# EAGLE design wrist - source (EAGLE 9.6.2)
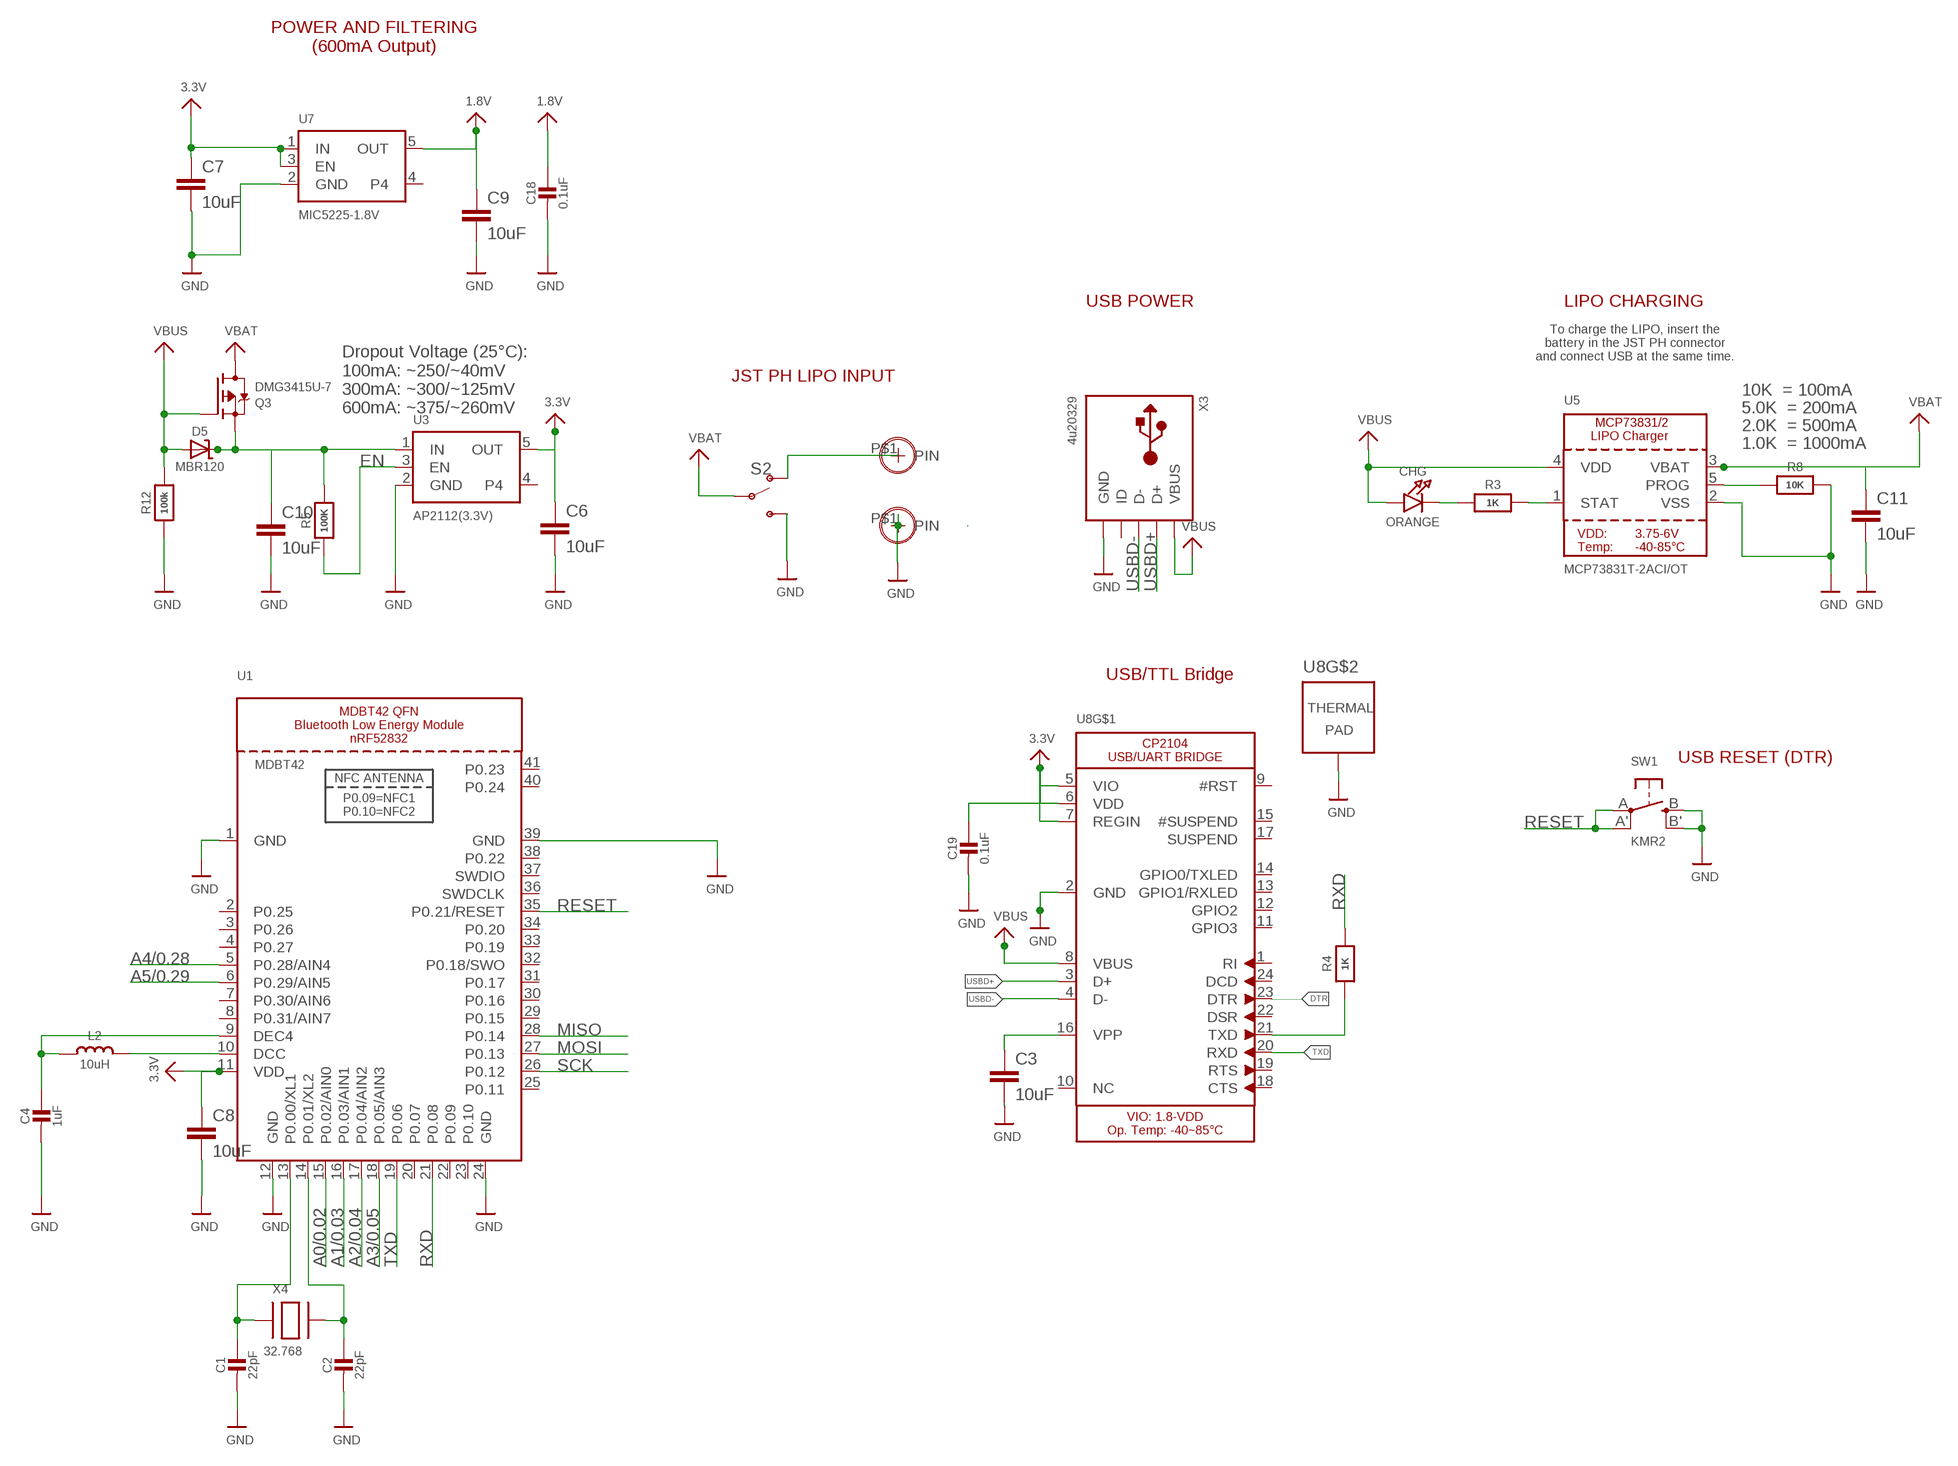
[diagram p0: schematic, sheet 1, part 1 of 2]
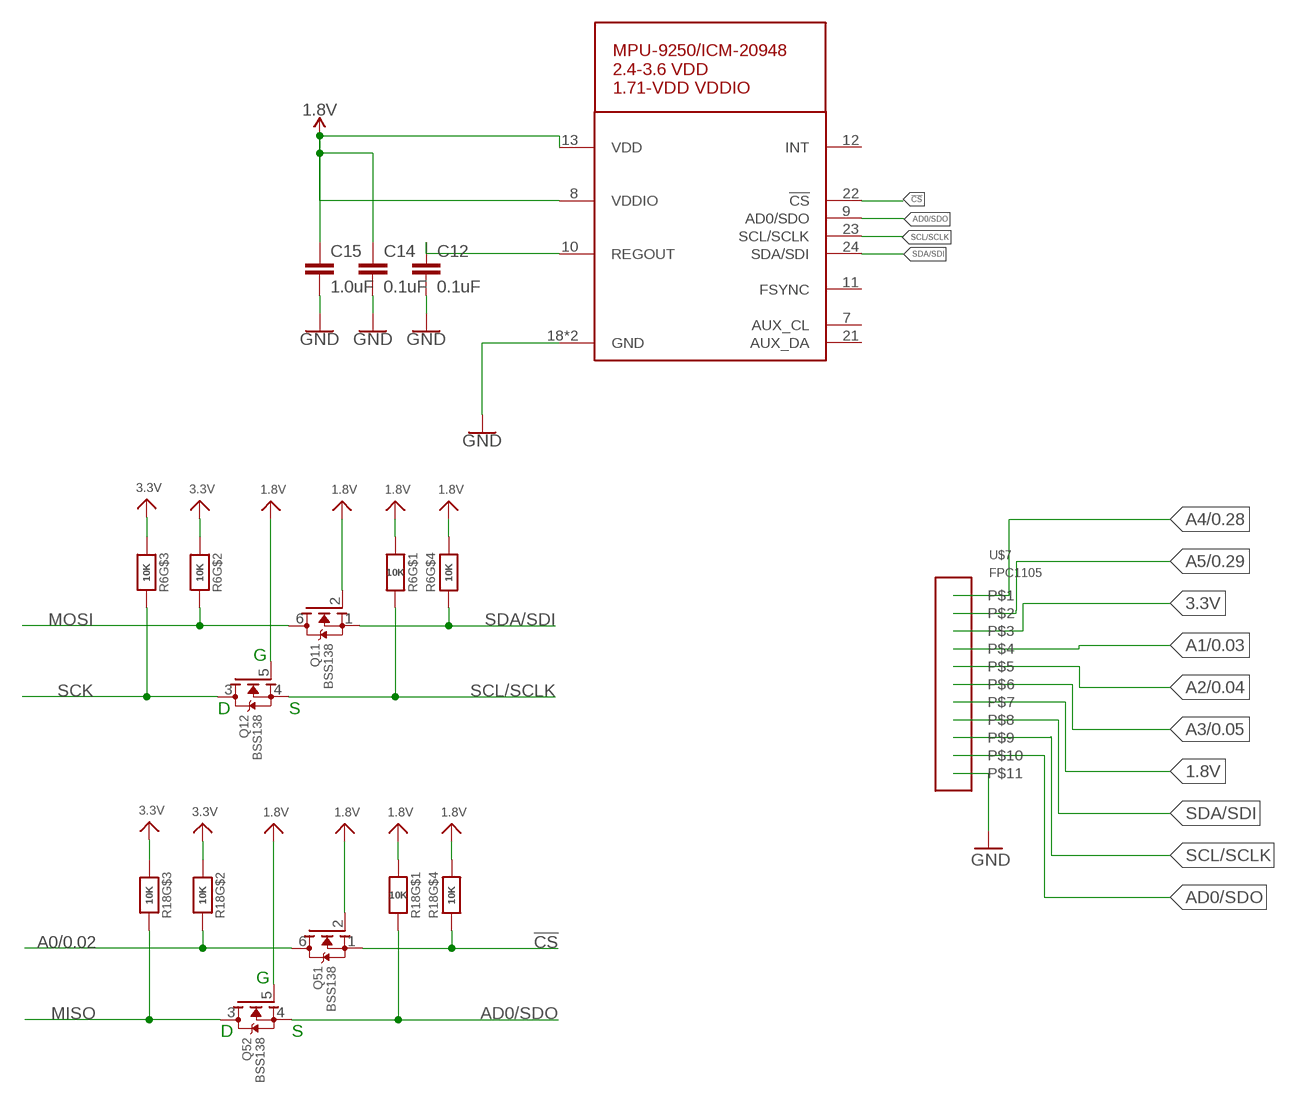
[diagram p1: schematic, sheet 1, part 2 of 2]

## Parts
C1  22pF  CAP_CERAMIC0603_NO  [0603-NO]
C2  22pF  CAP_CERAMIC0603_NO  [0603-NO]
C3  10uF  C-EUC0603  [C0603]
C4  1uF  CAP_CERAMIC0603_NO  [0603-NO]
C6  10uF  C-EUC0603  [C0603]
C7  10uF  C-EUC0603  [C0603]
C8  10uF  C-EUC0603  [C0603]
C9  10uF  C-EUC0603  [C0603]
C10  10uF  C-EUC0603  [C0603]
C11  10uF  C-EUC0603  [C0603]
C12  0.1uF  0.1UF-0603-25V-5%  [0603]
C14  0.1uF  0.1UF-0603-25V-5%  [0603]
C15  1.0uF  1.0UF-0603-16V-10%-X7R  [0603]
C18  0.1uF  CAP_CERAMIC0603_NO  [0603-NO]
C19  0.1uF  CAP_CERAMIC0603_NO  [0603-NO]
CHG  ORANGE  LED0805_NOOUTLINE  [CHIPLED_0805_NOOUTLINE]
D5  MBR120  DIODE-SCHOTTKYSOD-123  [SOD-123]
IC1  ADAFRUIT_SENSOR_MPU-9250_ICM20948  [ADAFRUIT_SENSOR_QFN24_3MM_NOEP]
L2  10uH  INDUCTOR0805-NO  [0805-NO]
Q1  BSS138  MOSFET-N_DUAL  [SOT363]
Q3  DMG3415U-7  MOSFET-P  [SOT23-R]
Q5  BSS138  MOSFET-N_DUAL  [SOT363]
R3  1K  RESISTOR_0603_NOOUT  [0603-NO]
R4  1K  RESISTOR_0603_NOOUT  [0603-NO]
R5  100K  RESISTOR_0603_NOOUT  [0603-NO]
R6  10K  RESISTOR_4PACK  [RESPACK_4X0603]
R8  10K  RESISTOR_0603_NOOUT  [0603-NO]
R12  100k  RESISTOR_0603_NOOUT  [0603-NO]
R18  10K  RESISTOR_4PACK  [RESPACK_4X0603]
S2  SWITCH-SPDT-SMD-RIGHT-ANGLE  [SWITCH_SPST_SMD_A]
SW1  KMR2  SWITCH_TACT_SMT4.6X2.8  [BTN_KMR2_4.6X2.8]
U1  MDBT42  NRF52832_MODULE_MDBT42  [BLE_MODULE_RAYTAC_MDBT42]
U3  AP2112(3.3V)  VREG_SOT23-5  [SOT23-5]
U5  MCP73831T-2ACI/OT  MCP73831/2  [SOT23-5]
U7  MIC5225-1.8V  VREG_SOT23-5  [SOT23-5]
U8  MICROBUILDER_CP2104  [MICROBUILDER_QFN24_4MM_SMSC]
U$7  FPC1105  [FPC1105]
U$9  M3-HOLE_M0.9-HOLE0.9MM  [M3-HOLE_M0.9-HOLE]
U$13  M3-HOLE_M0.9-HOLE0.9MM  [M3-HOLE_M0.9-HOLE]
X3  4u20329  USB_MICRO_20329_V2  [4UCONN_20329_V2]
X4  32.768  XTAL-3.2X1.5  [XTAL3215]

## Nets
1.8V [highpower]: C9.1 C14.1 C15.1 C18.1 IC1.8(VDDIO) IC1.13(VDD) Q1.2(1:G) Q1.5(2:G) Q5.2(1:G) Q5.5(2:G) R6.4 R6.8 R18.4 R18.8 U7.5(OUT) U$7.P$7
3.3V [highpower]: C6.1 C7.1 C8.1 C19.1 R6.2 R6.3 R18.2 R18.3 U1.11(VDD) U3.5(OUT) U7.1(IN) U7.3(EN) U8.5(VIO) U8.6(VDD) U8.7(REGIN) U$7.P$3
!CS: IC1.22(!CS) Q5.1(1:S) R18.5
A0/0.02: Q5.6(1:D) R18.7 U1.15(P0.02/AIN0)
A1/0.03: U1.16(P0.03/AIN1) U$7.P$4
A2/0.04: U1.17(P0.04/AIN2) U$7.P$5
A3/0.05: U1.18(P0.05/AIN3) U$7.P$6
A4/0.28: U1.5(P0.28/AIN4) U$7.P$1
A5/0.29: U1.6(P0.29/AIN5) U$7.P$2
AD0/SDO: IC1.9(AD0/SDO) Q5.4(2:S) R18.1 U$7.P$10
DTR [highpower]: U8.23(DTR)
EN [highpower]: R5.1 U3.3(EN)
GND [highpower]: C1.2 C2.2 C3.2 C4.2 C6.2 C7.2 C8.2 C9.2 C10.2 C11.2 C12.2 C14.2 C15.2 C18.2 C19.2 IC1.18(GND) IC1.20(GND) R8.2 R12.1 S2.3(S) SW1.B'(S1) SW1.B(S) U1.1(GND) U1.12(GND) U1.24(GND) U1.39(GND) U3.2(GND) U5.2(VSS) U7.2(GND) U8.2(GND) U8.THERM(TP) U$7.P$11 U$13.P$1(PIN) X3.BASE@1(GND) X3.BASE@2(GND) X3.GND X3.SPRT@1(GND) X3.SPRT@2(GND) X3.SPRT@3(GND) X3.SPRT@4(GND)
MISO: Q5.3(2:D) R18.6 U1.28(P0.14)
MOSI: Q1.6(1:D) R6.7 U1.27(P0.13)
N$1 [highpower]: C1.1 U1.13(P0.00/XL1) X4.P$1
N$2 [highpower]: C2.1 U1.14(P0.01/XL2) X4.P$2
N$3 [highpower]: L2.2 U1.10(DCC)
N$4 [highpower]: CHG.C R3.1
N$5 [highpower]: C3.1 U8.16(VPP)
N$6: C12.1 IC1.10(REGOUT)
N$8 [highpower]: C4.1 L2.1 U1.9(DEC4)
N$9 [highpower]: R3.2 U5.1(STAT)
N$10 [highpower]: R8.1 U5.5(PROG)
N$12 [highpower]: S2.1(O) U$9.P$1(PIN)
N$15 [highpower]: R4.1 U8.21(TXD)
RESET: SW1.A'(P1) SW1.A(P) U1.35(P0.21/RESET)
RXD [highpower]: R4.2 U1.21(P0.08)
SCK: Q1.3(2:D) R6.6 U1.26(P0.12)
SCL/SCLK: IC1.23(SCL/SCLK) Q1.4(2:S) R6.1 U$7.P$9
SDA/SDI: IC1.24(SDA/SDI) Q1.1(1:S) R6.5 U$7.P$8
TXD [highpower]: U1.19(P0.06) U8.20(RXD)
USBD+ [highpower]: U8.3(D+) X3.D+
USBD- [highpower]: U8.4(D-) X3.D-
VBAT [highpower]: C11.1 Q3.3(D) S2.2(P) U5.3(VBAT)
VBUS [highpower]: CHG.A D5.A Q3.1(G) R12.2 U5.4(VDD) U8.8(VBUS) X3.VBUS
VIN [highpower]: C10.1 D5.C Q3.2(S) R5.2 U3.1(IN)
Unconnected: IC1.7(AUX_CL) IC1.11(FSYNC) IC1.12(INT) IC1.21(AUX_DA) U1.2(P0.25) U1.3(P0.26) U1.4(P0.27) U1.7(P0.30/AIN6) U1.8(P0.31/AIN7) U1.20(P0.07) U1.22(P0.09) U1.23(P0.10) U1.25(P0.11) U1.29(P0.15) U1.30(P0.16) U1.31(P0.17) U1.32(P0.18/SWO) U1.33(P0.19) U1.34(P0.20) U1.36(SWDCLK) U1.37(SWDIO) U1.38(P0.22) U1.40(P0.24) U1.41(P0.23) U3.4 U7.4 U8.1(RI) U8.9(#RST) U8.10(NC) U8.11(GPIO3) U8.12(GPIO2) U8.13(GPIO1/RXLED) U8.14(GPIO0/TXLED) U8.15(#SUSPEND) U8.17(SUSPEND) U8.18(CTS) U8.19(RTS) U8.22(DSR) U8.24(DCD) X3.ID

## Notes on the sheet
- POWER AND FILTERING
  (600mA Output)
- USB POWER | LIPO CHARGING
- To charge the LIPO, insert the
  battery in the JST PH connector
  and connect USB at the same time.
- JST PH LIPO INPUT
- 10K  = 100mA
- Dropout Voltage (25°C):
  100mA: ~250/~40mV
  300mA: ~300/~125mV
  600mA: ~375/~260mV
- 5.0K  = 200mA
- 2.0K  = 500mA
- 1.0K  = 1000mA
- USB/TTL Bridge
- USB RESET (DTR)
- G
- D | S
- G
- D | S

## Library data of the parts
C1 C2 C4 C18 C19 = microbuilder:CAP_CERAMIC: Ceramic Capacitors For new designs, use the packages preceded by an '_' character since they are more reliable: The following footprints should be used on most boards: _0402 - Standard footprint for regular board layouts _0603 - Standard footprint for regular board layouts _0805 - Standard footprint for regular board layouts _1206 - Standard footprint for regular board layouts For extremely tight-pitch boards where space is at a premium, the following 'micro-pitch' footprints can be used (smaller pads, no silkscreen outline, etc.): _0402MP - Micro-pitch footprint for very dense/compact boards _0603MP - Micro-pitch footprint for very dense/compact boards _0805MP - Micro-pitch footprint for very dense/compact boards _1206MP - Micro-pitch footprint for very dense/compact boards
C3 C6-C11 = rcl:C-EU: CAPACITOR, European symbol; SPICEPREFIX: C
C12 C14 = SparkFun-Capacitors:0.1UF: 0.1µF ceramic capacitors A capacitor is a passive two-terminal electrical component used to store electrical energy temporarily in an electric field.; PROD_ID: CAP-08604
C15 = SparkFun-Capacitors:1.0UF: 1µF ceramic capacitors A capacitor is a passive two-terminal electrical component used to store electrical energy temporarily in an electric field.; PROD_ID: CAP-13930
CHG = microbuilder:LED: LED 0603 - 0603 Surface Mount Package 2mA: Green LED - Low Power (3.9mcd, 2ma, 1.7Vf) - Digikey: 475-2709-2-ND Orange LED - Low Power (9.8mcd, 2ma, 1.8Vf) - Digikey: 475-1194-2-ND Red LED - Low Power (5mcd, 2ma, 1.8Vf) - Digikey: 475-1195-2-ND Yellow LED - Low Power (7mcd, 2ma, 1.8Vf) - Digikey: 475-1196-2-ND 5mA: Blue LED - Low Power (17mcd, 5ma, 2.9Vf) - Digikey: LNJ937W8CRACT-ND 0805 - 0805 Surface Mount Package 2mA: Red LED (8.8mcd, 2mA, 1.8Vf, Clear) - Low Power [Digikey: 475-2510-1-ND] Green LED (5mcd, 2mA, 1.8Vf, Clear) - Low Power [Digikey: 475-2730-1-ND] Yellow LED (11.3mcd, 2mA, 1.8Vf, Clear) - Low Power [Digikey: 475-2555-1-ND] 20mA: Red LED (104mcd, 20mA, Diffused) - LS R976 [Digikey: 475-1278-6-ND] Red LED (12mcd, 20mA, 2.0Vf, Clear) - APT2012EC [Digikey: 754-1128-1-ND] Green LED (15mcd, 20mA, 2.2Vf, Clear) - APT2012GC [Digikey: 754-1131-1-ND] Orange LED (160mcd, 20mA, 2.1Vf, Clear) - APT2012SECK [Digikey: 754-1130-1-ND] 1206 - 1206 Surface Mount Package Green LED (26mcd, 20mA, Diffused) - LG N971 [Digikey: 475-1407-6-ND] Red LED (15mcd, 20mA, Diffused) - LH N974 [Digikey: 475-1416-6-ND] Cree - Cree High-Power Surface Mount LEDs XPEBWT-L1-0000-00D50 - White 111lm 350mA 2.9Vf 6200K 110° XTEAWT-00-0000-00000LEE3 - White 114lm 350mA 2.85Vf 5000K 115° Everlight - Everlight 45-21 Series Surface Mount LEDs 45-21/QK2C-B2832AC2CB2/2T - Warm White 2000mcd 20mA 3.25Vf 3050K 120° 45-21/LK2C-B38452C4CB2/2T - Nuetral White 2000mcd 20mA 3.25Vf 4150K 120° 45-21/LK2C-B50634C6CB2/2T - Cold White 2200mcd 20mA 3.25Vf 5650K 120° PLCC2 Reverse Mount LS T77K-J1L2-1-0-2-R18-Z - Red 11.25mcd 2mA 1.8Vf 630nm 120° LO T77K-L1M2-24-Z - Orange 19.6mcd 2mA 1.8Vf 606nm 120° LY T77K-K2M1-26-Z - Yellow 15.7mcd 2mA 1.8Vf 587nm 120°
D5 = microbuilder:DIODE-SCHOTTKY
IC1 = Adafruit ICM20948:ADAFRUIT_SENSOR_MPU-9250: MPU-9250 3-Axis gyroscope and 3-Axis accelerometer
L2 = microbuilder:INDUCTOR: Inductors 0603: 10nH Ceramic Inductor - microwire antenna/RF (Digikey: 712-1434-2-ND) 0805: 560nH Ceramic Inductor - RF (Digikey: 553-1047-1-ND) 270nH Ceramic Inductor - Q = 40@250MHz, +-5%, 1 Ohm DC Resistance (Digikey: 535-10506-2-ND) 1007 (2518 Metric) SMT: 10µH 10% 250mOhm 820mA 1007 Inductor (Digikey: 587-2189-1-ND) 22µH 10% 500mOhm 580mA 1007 Inductor (Digikey: 587-2190-1-ND) 47µH 10% 950mOhm 420mA 1007 Inductor (Digikey: 587-2191-1-ND) 47µH 5% 100mOhm 1A 1008 Inductor (Digikey: 732-1816-1-ND) 5.0x5.0mm (Taiyo Yuden NR5040 Series) 6.8µH 20% 2.3A 64mOhm Inductor (Digikey: 587-2374-2-ND) 5.0x5.0mm (TDK VLC5045 Series) 4.7µH 20% 3.3A 34mOhm Inductor (Digikey: 445-6526-1-ND) 6.8µH 20% 2.7A 46mOhm Inductor (Digikey: 445-6527-1-ND) 6.0x6.0mm (TDK VLC6045 Series) 4.7µH 20% 3.8A 27mOhm Inductor (Digikey: 445-6538-2-ND) 6.8µH 20% 3A 41mOhm Inductor (Digikey: 445-6540-1-ND) 6.2µH 30% 2.2A 45mOhm Inductor (Digikey: SRR5028-6R2YCT-ND) - Not TDK VLC6045 but footprint should match 6.0x6.0mm (TDK SLF6045 Series) 6.8uH 30% 2A 33mOhm Inductor (Digikey: 445-4572-1-ND, Mouser: 810-SLF645T6R8N2R0PF) 6.0x6.0mm (Sumida CDRH5D28 Series) 6.2uH 30% 1.8A 45mOhm Inductor (Digikey: 308-1542-1-ND) Taiyo Yuden NR3015T2R2M - 2.2uH 20% 1.5A (Digikey: 587-1648-2-ND, Mouser: 963-NR3015T2R2M) - Used with TI TPS62172 CoilCraft RFID Transponder Coil - MA5532-AE (For use with AS3935 Lightning Sensor) Taiyo Yuden NRH2412T2R2MNGH - 2.2uH 20% 1AA (Digikey: 587-3443-1-ND) - Used with TI LM3671 Vishay IHLP 1.0uH Molded Inductor - 24mOhm DCR, 5A, +/-20%, -55°C-125°C (Digikey: 541-1319-1-ND)
Q1 Q5 = microbuilder:MOSFET-N_DUAL: Dual N-Channel MOSFET SOT363 (2.0x1.25mm) 2N7002PS - 60V, 320mA [Digikey: 568-5984-1-ND]
Q3 = microbuilder:MOSFET-P: P-Channel Mosfet LEGEND VDS: Voltage Drain-Source ID: Drain Current RDS(ON): Drain-Source On-State Resistance VGS(TH): Gate-Source Threshold Voltage CISS: Drain-Source Input Capacitance SOT-23 Name VDS ID RDS(ON) VGS(TH) CISS Order Number IRLML5103 30V 760mA 600 mOhm -- 75pF @ 25V Digikey: IRLML5103PBFCT-ND IRLML6401 12V 4.3A 50 mOhm 950mV @ 250µA 830pF @ 10V Digikey: IRLML6401PBFTR-ND NTR0202PL 20V 400mA 800 mOhm 2.3V @ 250uA 70pF @ 5V Digikey: NTR0202PLT1GOSTR-ND NTR4101PT1G 20V 1.8A 85 mOhm 1.2V @ 250uA 675pF @ 10V Digikey: NTR4101PT1GOSCT-ND DMP2004K 20V 600mA 900 mOhm 1V @ 250uA 175pF @ 16V Digikey: DMP2004KDICT-ND PMV65XP 20V 3.9A 76 mOhm 950mV @ 1mA 725pF @ 20V Digikey: 568-2358-2-ND TO-252 Name VDS ID RDS(ON) VGS(TH) CISS Order Number AOD417 30V 25A 34 mOhm 3V @ 250µA 920pF @ 15V Digikey: 785-1106-2-ND
R3-R5 R8 R12 = microbuilder:RESISTOR: Resistors For new designs, use the packages preceded by an '_' character since they are more reliable: The following footprints should be used on most boards: _0402 - Standard footprint for regular board layouts _0603 - Standard footprint for regular board layouts _0805 - Standard footprint for regular board layouts _1206 - Standard footprint for regular board layouts For extremely tight-pitch boards where space is at a premium, the following 'micro-pitch' footprints can be used (smaller pads, no silkscreen outline, etc.): _0402MP - Micro-pitch footprint for very dense/compact boards _0603MP - Micro-pitch footprint for very dense/compact boards _0805MP - Micro-pitch footprint for very dense/compact boards _1206MP - Micro-pitch footprint for very dense/compact boards
R6 R18 = microbuilder:RESISTOR_4PACK: Resistor Packs (4 resistors) 4 x 0603 10K 1/16W - Digikey: YC164J-10KCT-ND
S2 = SparkFun-Switches:SWITCH-SPDT: Single Pole, Double Throw (SPDT) Switch Single-pole, double-throw (SPDT) switch. Variant Overview SMD-AYZ0202 Surface Mount DPDT Switch <https://www.sparkfun.com/products/597> (COM-00597) Used on e.g. LilyPad Arduino USB - ATmega32U4 Board <https://www.sparkfun.com/products/12049> PTH-11.6X4.0MM SPDT Mini Power Switch <https://www.sparkfun.com/products/102> (COM-00102) Used on e.g. SparkFun Simon Says - Through-Hole Soldering Kit <https://www.sparkfun.com/products/10547> (KIT-10547) PTH-11.6X4.0MM-KIT KIT version of SPDT Mini Power Switch - Simplifies soldering by removing tStop of switch pins - only one side can be soldered. PTH-11.6X4.0MM-LOCK LOCK version of SPDT Mini Power Switch - Offset pins hold switch in place for easier soldering. SMD-RIGHT-ANGLE Surface Mount Right Angle Switch <https://www.sparkfun.com/products/10860> (COM-10860) Used on e.g. SparkFun ESP8266 Thing <https://www.sparkfun.com/products/13231>; PROD_ID: SWCH-10651; SF_SKU: COM-10860
SW1 = microbuilder:SWITCH_TACT_SMT: SMT Tact Switches 6x6mm - Digikey: P12940SCT-ND KMR2 (4.6x2.8mm) - Digikey: 401-1426-1-ND EVQ-PQHB55 - Light Touch, 160GF (4.5x4.5mm) - Digikey: P8090SCT-ND KMT0 - KMT021 NGJ LHS (etc.) IP68/Waterproof - Digikey: CKN10289CT-ND
U1 = microbuilder:NRF52832_MODULE_MDBT42: MDBT42 - BLE Module (nRF52832 QFN) VDD: 1.7-3.6V
U3 U7 = microbuilder:VREG_SOT23-5: SOT23-5 Fixed Voltage Regulators Part Current Out V Out V In V Dropout θJA (°C/W) TJ (°C) Digikey Part No. ADP121 150mA 3.3V 3.4-5.5V 0.09V @ 150mA -- -- ADP121-AUJZ33R7CT-ND ADP121 150mA 3.0V 3.1-5.5V 0.09V @ 150mA -- -- ADP121-AUJZ30R7CT-ND ADP122 300mA 3.3V 3.4-5.5V 0.085V @ 300mA -- -- ADP122AUJZ-3.3-R7CT-ND ADP1712 300mA 3.3V 3.5-5.5V 0.17V @ 300mA -- -- ADP1712AUJZ-3.3-R7TR-ND AP7311 (Low Cost) 150mA 3.3V 3.5-6V 0.15V @ 150mA -- -- AP7311-33WG-7DICT-ND LD39015M18R 150mA 1.8V 1.9V-5.5V 0.08V @ 100mA -- -- 497-6977-1-ND LP2985A-33DBVR 150mA 3.3V 3.3-16V 0.28V @ 150mA 206 150 296-18479-1-ND MCP1824T-3302E/OT 300mA 3.3V 3.5V-6V 0.2V @ 300mA -- -- MCP1824T-3302E/OTCT-ND MIC5205-2.5YM5 TR 150mA 2.5V 2.7-16V 0.165V @ 150mA -- -- 576-1257-2-ND MIC5205-3.0YM5 TR 150mA 3.0V 3.2V-16V 0.165V @ 150mA -- -- 576-1258-2-ND MIC5205-3.3YM5 TR 150mA 3.3V 3.5V-16V 0.165V @ 150mA -- -- 576-1259-2-ND TPS780330220 150mA 3.3V+2.2V 3.6-5.5V 250mV Max -- -- 296-23332-1-ND TDA3663/N1,135 100mA 3.3V 3.5-45V 0.18V @ 50mA -- -- 568-5343-1-ND Max operating temp can be calculated using θJA, TJ (max junction temperature), and power in watts. Set the "Maximum Ambient Temperature" until it reaches TJ ("Max Junction Temperature"), which is the absolute limit for safe use of the regulator: Heat Sink Temperature Calculator <http://www.daycounter.com/Calculators/Heat-Sink-Temperature-Calculator.phtml> For example, With 12V source into a 3.3V LP2985 and a 30mA load, we are dissipating (12V-3.3V) * 0.03A = 0.261W. With a θJA of 206 °C/W, a TJ of 150°C, and 261mW we can safely use the chip without a heat sink up to 75°C (=147.1°C Junction Temperature).
U5 = microbuilder:MCP73831/2: MCP73831/2 LIPO Charger VDD: 3.75 - 6V Temp -40 - 85°C Programmable Charge Rate: 15-500mA NOTE: STAT is a tri-state logic output on the MCP73831 and an open-drain output on the MCP73832. SOT23-5 with 4.2V output and tri-state logic on STAT = MCP73831T-2ACI/OT
U8 = Adafruit nRF52 Bluefruit Feather:MICROBUILDER_CP2104: CP2104 - USB to UART Bridge VDD Output: 3.45V
U$7 = my_library:FPC1105
U$9 U$13 = 3M_Hole:M3-HOLE_M0.9-HOLE
X3 = microbuilder:USB: USB Connectors USBMINIB - Surface Mount Female Mini-B USB Connector 4UConnector: 06564
X4 = adafruit2:XTAL: Low cost SMT crystals, no capacitors included http://www.ladyada.net/library/eagle

## Net classes
0 default: width 0.203 mm
1 highpower: width 0.254 mm, drill 0.483 mm

## Board
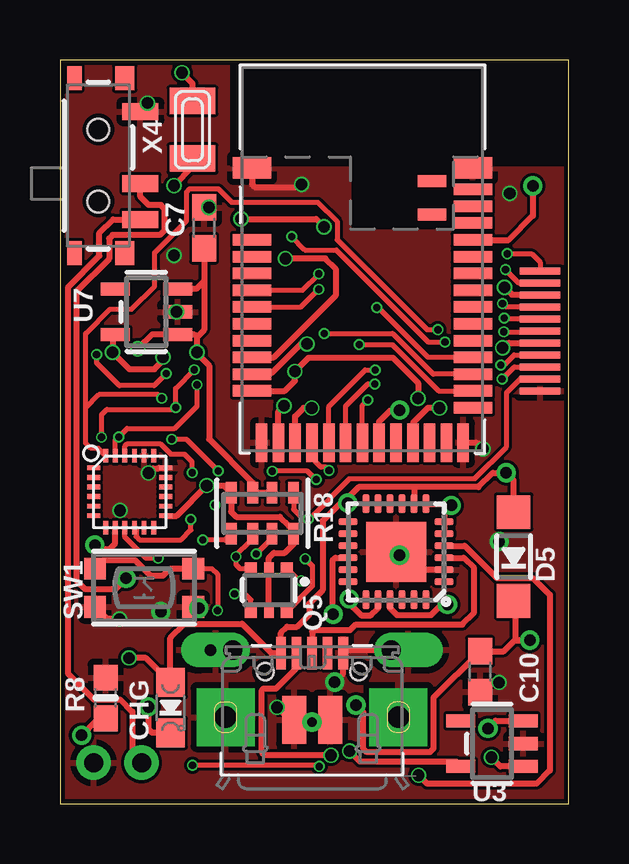
[diagram p2: board, top side]
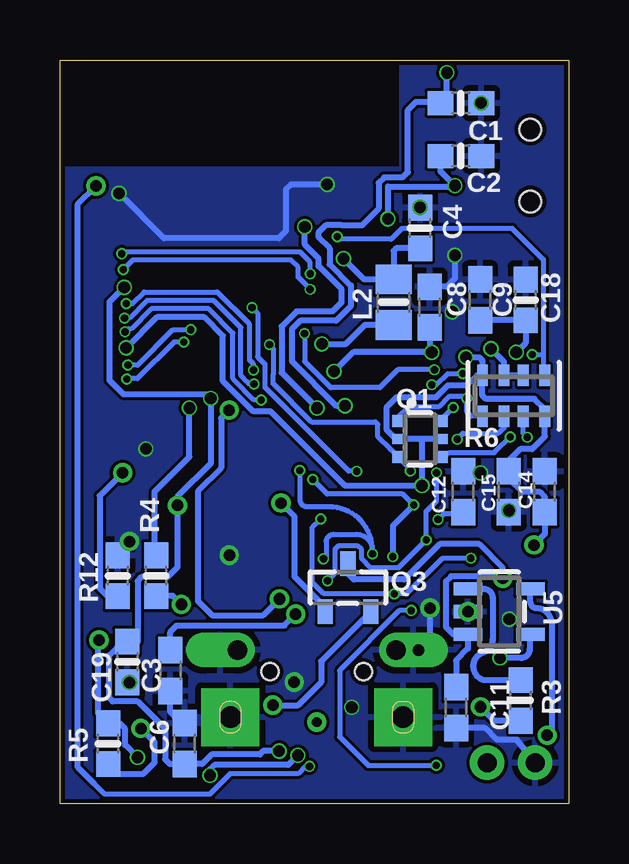
[diagram p3: board, bottom side, seen from below]

Size 21.2 x 31 mm. Coordinates in mm from the lower left corner, seen from the top.
Outline: 0,0 21.2,0 21.2,31 0,31 0,0
Copper layers (1*16): Top 0.035mm / dielectric 1.6mm / Bottom 0.035mm
Design rules "jlcpcb-2layers *": minimum track width 5mil, minimum drill 0.3mm, track to track 5mil, track to pad 5mil, pad to pad 5mil, via to via 5mil, smd to smd 5mil, copper to edge 0.2mm, drill to drill 6mil, minimum pad ring 10mil, minimum via ring 3mil, stop-mask expansion 4mil, vias tented up to drill 20mil, thermal gap 10mil

### Footprints (pad centres in the part's own frame; a part is rotated, then mirrored left to right if it is on the bottom)
0603-NO = smd 1.075 x 1: 1 -0.85,0; 2 0.85,0
C0603 = smd 1.1 x 1: 1 -0.85,0; 2 0.85,0
0603 = smd 1.1 x 1: 1 -0.85,0; 2 0.85,0
CHIPLED_0805_NOOUTLINE = smd 1.2 x 1.2: A 0,-1.05; C 0,1.05
SOD-123 = smd 1.4 x 1.4: A 1.85,0; C -1.85,0
ADAFRUIT_SENSOR_QFN24_3MM_NOEP = smd 0.55 x 0.2: 1 -1.5,1; 2 -1.5,0.6; 3 -1.5,0.2; 4 -1.5,-0.2; 5 -1.5,-0.6; 6 -1.5,-1; 13 1.5,-1; 14 1.5,-0.6; 15 1.5,-0.2; 16 1.5,0.2; 17 1.5,0.6; 18 1.5,1 | smd 0.2 x 0.55: 7 -1,-1.5; 8 -0.6,-1.5; 9 -0.2,-1.5; 10 0.2,-1.5; 11 0.6,-1.5; 12 1,-1.5; 19 1,1.5; 20 0.6,1.5; 21 0.2,1.5; 22 -0.2,1.5; 23 -0.6,1.5; 24 -1,1.5
0805-NO = smd 1.24 x 1.5: 1 -0.95,0; 2 0.95,0
SOT363 = smd 0.5 x 0.5: 1 -0.75,-0.9; 3 0.75,-0.9; 4 0.75,0.9; 6 -0.75,0.9 | smd 0.4 x 0.5: 2 0,-0.9; 5 0,0.9
SOT23-R = smd 0.635 x 1.016: 1 -0.95,-1; 2 0.95,-1; 3 0,1
RESPACK_4X0603 = smd 0.45 x 0.9: 1 -1.3,-0.85; 2 -0.4,-0.85; 3 0.4,-0.85; 4 1.3,-0.85; 5 1.3,0.85; 6 0.4,0.85; 7 -0.4,0.85; 8 -1.3,0.85
SWITCH_SPST_SMD_A = smd 0.7 x 1.5: 1 -2.25,-1.75; 2 -0.75,-1.75; 3 2.25,-1.75 | smd 1 x 0.6: GND1 -3.65,1; GND3 3.65,1 | smd 1 x 0.8: GND2 -3.65,-1.1; GND4 3.65,-1.1 | hole 0.9: -1.5,0; 1.5,0
BTN_KMR2_4.6X2.8 = smd 0.9 x 0.9: A 2.05,0.8; A' -2.05,0.8; B 2.05,-0.8; B' -2.05,-0.8
BLE_MODULE_RAYTAC_MDBT42 = smd 1.6 x 0.9: 1 -4.6,3.8; 39 4.6,3.8 | smd 1.6 x 0.48: 2 -4.6,0.8; 3 -4.6,0.1; 4 -4.6,-0.6; 5 -4.6,-1.3; 6 -4.6,-2; 7 -4.6,-2.7; 8 -4.6,-3.4; 9 -4.6,-4.1; 10 -4.6,-4.8; 11 -4.6,-5.5; 25 4.6,-6.2; 26 4.6,-5.5; 27 4.6,-4.8; 28 4.6,-4.1; 29 4.6,-3.4; 30 4.6,-2.7; 31 4.6,-2; 32 4.6,-1.3; 33 4.6,-0.6; 34 4.6,0.1; 35 4.6,0.8; 36 4.6,1.5; 37 4.6,2.2; 38 4.6,2.9 | smd 0.48 x 1.6: 12 -4.2,-7.65; 13 -3.5,-7.65; 14 -2.8,-7.65; 15 -2.1,-7.65; 16 -1.4,-7.65; 17 -0.7,-7.65; 18 0,-7.65; 19 0.7,-7.65; 20 1.4,-7.65; 21 2.1,-7.65; 22 2.8,-7.65; 23 3.5,-7.65; 24 4.2,-7.65 | smd 1.2 x 0.5: 40 2.9,3.25; 41 2.9,1.85
SOT23-5 = smd 0.55 x 1.2: 1 -0.95,-1.3; 2 0,-1.3; 3 0.95,-1.3; 4 0.95,1.3; 5 -0.95,1.3
MICROBUILDER_QFN24_4MM_SMSC = smd 0.8 x 0.28: 1 -2,1.25; 2 -2,0.75; 3 -2,0.25; 4 -2,-0.25; 5 -2,-0.75; 6 -2,-1.25; 13 2,-1.25; 14 2,-0.75; 15 2,-0.25; 16 2,0.25; 17 2,0.75; 18 2,1.25 | smd 0.28 x 0.8: 7 -1.25,-2; 8 -0.75,-2; 9 -0.25,-2; 10 0.25,-2; 11 0.75,-2; 12 1.25,-2; 19 1.25,2; 20 0.75,2; 21 0.25,2; 22 -0.25,2; 23 -0.75,2; 24 -1.25,2 | smd 2.5 x 2.5: THERM 0,0
FPC1105 = smd 0.3 x 1.7: P$1 -2,0; P$2 -1.5,0; P$3 -1,0; P$4 -0.5,0; P$5 0,0; P$6 0.5,0; P$7 1,0; P$8 1.5,0; P$9 2,0; P$10 2.5,0; P$11 3,0
M3-HOLE_M0.9-HOLE = drill 0.8 pad 0.55: P$1 0,0
4UCONN_20329_V2 = smd 1 x 2: BASE@1 -0.75,-2; BASE@2 0.75,-2 | smd 0.4 x 1.35: D+ 0,0.775; D- -0.65,0.775; GND 1.3,0.775; ID 0.65,0.775; VBUS -1.3,0.775 | drill 0.8 pad 1.143 offset: SPRT@1 -3.3,0.9; SPRT@2 3.3,0.9 | drill 0.9 pad 2.413 square: SPRT@3 -3.6,-1.9; SPRT@4 3.6,-1.9 | hole 0.7: -1.95,0; 1.95,0
XTAL3215 = smd 1.1 x 1.9: P$1 1.2,0; P$2 -1.2,0

### Placement (x,y rotation side)
C1  4.5,29.2 0 bottom
C2  4.5,27 0 bottom
C3  16.6,5.54 270 bottom
C4  6.2,24 90 bottom
C6  16,2.5 90 bottom
C7  6,24 90 top
C8  5.8,20.7 90 bottom
C9  3.7,21 90 bottom
C10  17.5,5.5 270 top
C11  4.7,4 270 bottom
C12  4.4,13 90 bottom
C14  1,13 90 bottom
C15  2.5,13 270 bottom
C18  1.8,21 90 bottom
C19  18.4,5.9 270 bottom
CHG  4.6,4 180 top
D5  18.9,10.3 90 top
IC1  2.9,13 0 top
L2  7.3,20.9 270 bottom
Q1  6.2,15.2 270 bottom
Q3  9.2,9 0 bottom
Q5  8.7,8.9 180 top
R3  2,4.3 90 bottom
R4  17.2,9.5 90 bottom
R5  19.2,2.5 90 bottom
R6  2.3,17 180 bottom
R8  1.9,4.4 90 top
R12  18.8,9.5 270 bottom
R18  8.43,12.1 180 top
S2  1.6,26.6 90 top
SW1  3.5,9 0 top
U1  12.6,22.7 0 top
U3  18,2.5 90 top
U5  2.9,8 270 bottom
U7  3.6,20.5 90 top
U8  14,10.5 180 top
U$7  20,20.2 270 top
U$9  3.4,1.7 0 bottom
U$13  1.4,1.7 0 bottom
X3  10.5,5.5 0 top
X4  5.52,28.09 90 top

### Tracks (layer width: path | path; a pad name or v marks a point on that pad's centre or on a via)
1.8V  (via drill 0.48, 0.48 pad 0.8)
  Top 0.254: Q5.5 Q5.2 8.7,10.24 8.91,10.46 9.37,10.46 9.74,10.82 R18.8 9.73,11.57 9.55,11.57 9.16,11.95 7.34,11.95 7.13,12.16 R18.4 6.83,13.26 v6.12,13.26 4.86,12 IC1.13 | v1.45,10.78 1.63,10.6 2.05,10.6 2.3,10.85 IC1.8 | v18.45,19 18.64,19.19 18.69,19.19 18.7,19.2 U$7.P$7 | v4.29,18.61 4.29,18.47 3.93,18.11 2.89,18.11 v2.19,18.81 2.19,19.44 U7.5
  Bottom 0.254: 1,11.24 C14.1 1,12.78 1.2,12.98 1.92,12.98 2.5,13.56 C15.1 2.5,14.3 2.02,14.78 1.53,14.78 1,15.31 R6.8 1,16.44 1.43,16.87 3.46,16.87 3.6,17.01 R6.4 | 1,11.24 | 1,11.24 v1.45,10.79 v1.45,10.78 | R6.4 3.82,17.85 4.22,17.45 5.03,17.45 5.54,16.93 7.18,16.93 7.6,16.51 7.6,15.6 7.21,15.2 Q1.2 6.17,15.2 | R6.4 3.6,18.47 3.74,18.61 v4.29,18.61 | v18.45,19 17.17,20.27 15.19,20.27 14.41,19.49 14.41,17.61 13.14,16.35 12.42,16.35 9.34,13.27 v6.13,13.27 v6.12,13.26 6.12,13.66 | C9.1 C18.1 1.8,19.2 v2.19,18.81 | Q1.5 6.17,15.2 | 6.12,13.66 | 6.17,15.2 6.12,15.15 6.12,13.66
3.3V  (via drill 0.48, 0.48 pad 0.8)
  Top 0.254: U8.5 U8.6 16,11.85 16.02,11.87 16.02,12.43 15.95,12.5 | 15.95,12.5 16.24,12.5 v16.31,12.43 | U3.5 16.5,1.75 12.51,1.75 v12.07,2.19 | R18.2 R18.3 8.03,13.37 6.21,15.19 6.21,18.27 5.71,18.76 v5.71,18.82 5.71,19.45 | v14.92,16.89 14.92,17.54 13.88,18.57 10.35,18.57 v9.79,18.01 9.79,17.62 9.37,17.2 U1.11 | 5.71,19.45 5.61,19.55 U7.1 4.88,19.57 3.85,19.57 v3.24,18.96 | C7.1 6,21.78 | U7.3 5.67,21.45 6,21.78 | U8.7 15.95,12.5 | v18.52,21.52 18.84,21.21 U$7.P$3 | 6,21.78 6,19.74 5.71,19.45
  Bottom 0.254: R6.2 R6.3 2.7,18.42 v3.24,18.96 | v12.07,2.19 12.74,2.19 12.88,2.05 14.88,2.05 15.28,1.65 C6.1 16.62,1.65 16.82,1.85 16.82,3.11 17.97,4.26 19,4.26 19.15,4.41 19.15,6.19 18.58,6.76 C19.1 17.97,6.74 17.97,9.28 17.8,9.44 16.71,9.44 16.31,9.85 v16.31,12.43 16.31,12.8 14.91,14.2 14.91,16.89 v14.92,16.89 15.09,17.06 18.55,17.06 19.14,17.65 19.14,20.91 v18.52,21.52 | v9.79,18.01 8.98,18.82 v5.71,18.82 5.8,18.91 C8.1
!CS  (via drill 0.3)
  Top 0.203: R18.5 6.87,10.99 v5.94,10.99 | IC1.22 2.7,14.9 2.81,15.01 4.17,15.01 4.62,14.55 5.2,14.55 5.51,14.24 v5.51,13.79 | v10.06,9.29 9.96,9.29 Q5.1
  Bottom 0.203: v10.06,9.29 9.75,9.6 9.75,10.6 9.61,10.74 8.79,10.74 8.64,10.59 8.64,10.22 8.24,9.83 7.1,9.83 v5.94,10.99 5.94,12.18 5.51,12.61 v5.51,13.79
A0/0.02  (via drill 0.3)
  Top 0.203: Q5.6 10.52,9.07 10.52,9.91 v10.22,10.21 | v8.18,10.41 8.34,10.57 8.35,10.57 8.83,11.05 R18.7 | U1.15 10.55,15 10.55,14.34 10.87,14.02 11.08,14.02 v11.21,13.89
  Bottom 0.203: v11.21,13.89 11.2,13.88 11.2,12.67 arc-90 10.9,12.37 9.99,12.37 arc90 8.18,10.56 | v10.22,10.21 arc-90 10.11,10.32 10.11,10.91 arc90 9.8,11.22 8.84,11.22 arc90 8.18,10.56 | v8.18,10.41 8.18,10.56
A1/0.03  (via drill 0.3)
  Top 0.203: U1.16 11.2,16.56 12.71,18.07 v13.14,18.07 | U$7.P$4 18.58,20.7 v18.44,20.84
  Bottom 0.203: v13.14,18.07 13.14,18.32 13.3,18.48 13.3,19.98 14.65,21.33 17.7,21.33 18.19,20.84 v18.44,20.84
A2/0.04  (via drill 0.3)
  Top 0.203: U1.17 11.9,16.57 12.82,17.5 v13.12,17.5 | U$7.P$5 18.55,20.2 v18.51,20.25
  Bottom 0.203: v18.51,20.25 18.3,20.25 17.58,20.97 14.8,20.97 13.66,19.84 13.66,17.86 13.39,17.58 13.3,17.5 v13.12,17.5
A3/0.05  (via drill 0.3)
  Top 0.203: U1.18 12.6,16.61 v12.82,16.83 | v18.49,19.67 19.97,19.67 U$7.P$6
  Bottom 0.203: v12.82,16.83 13.12,16.83 13.95,17.65 13.95,17.67 13.99,17.72 13.99,19.62 15.01,20.63 17.39,20.63 18.23,19.79 18.36,19.79 v18.49,19.67
A4/0.28  (via drill 0.3)
  Top 0.203: U1.5 10.1,21.4 v10.78,22.08 | v18.63,22.92 19.65,22.92 20,22.57 U$7.P$1
  Bottom 0.203: v10.78,22.08 10.78,22.57 11.2,22.99 18.56,22.99 v18.63,22.92
A5/0.29  (via drill 0.3)
  Top 0.203: U1.6 10.04,20.7 v10.78,21.44 | v18.56,22.26 19.12,21.7 U$7.P$2
  Bottom 0.203: v10.78,21.44 11.28,21.94 11.28,22.36 11.58,22.66 18.16,22.66 v18.56,22.26
AD0/SDO  (via drill 0.3)
  Top 0.203: v4.09,10.23 3.58,10.23 2.7,11.11 IC1.9 | U$7.P$10 19.18,17.7 18.61,17.14 18.61,14.87 17.29,13.55 12.08,13.55 10.4,11.87 v10.34,11.87 10.13,11.87 9.73,12.27 R18.1 | Q5.4 7.95,8.49 7.71,8.73 v7.27,8.73
  Bottom 0.203: v4.09,10.23 5.27,10.23 6.76,8.73 v7.27,8.73 7.28,8.74 10.21,8.74 10.68,9.21 10.68,11.53 v10.34,11.87
EN  (via drill 0.48 pad 0.8)
  Top 0.254: v17.83,3.13 18.15,3.45 U3.3
  Bottom 0.254: R5.1 18.78,1.23 17.75,1.23 17.26,1.72 17.26,2.56 v17.83,3.13
GND  (via drill 0.48, 0.48 pad 0.8)
  Top 0.254: X3.SPRT@2 11.93,6.4 X3.GND 11.8,5.81 11.77,5.78 11.77,5.39 v11.44,5.06 | U8.2 14.75,9.75 v14.14,10.36 U8.THERM | X3.SPRT@1 v6.28,6.4 v6.27,6.39 | SW1.B' 1.96,7.69 v2.48,7.69 | C7.2 C4.2 | C10.2 17.9,5.05 v18.3,5.05 | v3.68,13.78 3.87,13.97 4.11,13.97 4.13,14 IC1.18 | U1.24 17.36,15.05 v17.62,14.79 | U1.1 8,25.82 8.14,25.68 9.94,25.68 v10.07,25.81 | X3.BASE@1 9.55,3.5 v9.04,4.01 | S2.3 3.35,28.9 C1.2 | U7.2 v4.86,20.5
  Bottom 0.254: C6.2 16.39,3.54 16.39,3.61 16.6,3.82 C3.2 | R12.1 18.3,10.85 v18.3,10.92 | v6.27,6.39 5.78,6.88 v5.78,8.15 | U$13.P$1 2.17,2.66 3,2.66 3.49,3.15 C11.2 | C12.2 4.33,13.78 v3.68,13.78 | C15.2 v2.5,12.22 | C19.2 v18.3,5.05 | v18.74,25.44 16.87,23.57 12.08,23.57 11.79,23.86 11.79,25.61 11.58,25.81 v10.07,25.81 | v4.75,22.85 4.75,21.89 5.09,21.55 C8.2
  other vias: 4.2,8 6.2,24.85 3.65,29.2
  pour Top: 0,31 7,31 7,26.5 21,26.5 21,-0.08 0,-0.08
  pour Bottom: 0,31 7,31 7,26.5 21.42,26.5 21.42,-0.09 0,-0.09
MISO  (via drill 0.3)
  Top 0.203: v13.2,20.67 13.26,20.67 15.33,18.6 U1.28 | 7.94,11.15 7.94,10.95 7.33,10.34 v7.33,10.29 7.33,9.96 7.49,9.8 Q5.3 | v10.67,13.51 v10.66,13.51 10.31,13.86 v8.84,13.86
  Top 0.254: 7.94,11.15 R18.6
  Bottom 0.203: v13.2,20.67 12.97,20.44 12.97,18.62 12.65,18.3 12.65,17.34 9.17,13.86 v8.84,13.86 | v6.46,12.45 6.92,12.9 10.07,12.9 v10.67,13.51
  Bottom 0.254: v6.46,12.45 7.33,11.58 v7.33,10.29
MOSI  (via drill 0.3)
  Top 0.203: v5.6,18.09 4.82,17.3 v4.82,16.5 4.82,16.43 1.95,16.43 1.73,16.21 v1.73,15.27 | v11.01,19.6 13.86,19.6 15.55,17.91 U1.27
  Bottom 0.203: Q1.6 5.3,16.02 v4.82,16.5 | v1.73,15.27 1.9,15.44 R6.7 | v5.6,18.09 7.12,18.09 7.87,17.34 9.91,17.34 11.01,18.44 v11.01,19.6
N$1  (via drill 0.48)
  Top 0.254: U1.13 9.1,16.35 v9.33,16.58 | v5.08,30.47 5.52,30.03 X4.P$1
  Bottom 0.254: v9.33,16.58 9.68,16.58 11.54,18.44 11.54,19.77 11.18,20.13 9.69,20.13 9.08,20.74 9.08,21.6 9.96,22.48 9.96,23.15 10.44,23.62 10.44,23.8 10.12,24.11 9.45,24.11 9.44,24.1 8.62,24.1 7.92,24.8 7.92,25.88 7.7,26.1 6.93,26.1 6.71,26.32 6.71,28.91 6.36,29.26 5.41,29.26 C1.1 5.08,29.51 v5.08,30.47
N$2  (via drill 0.48)
  Top 0.254: U1.14 9.8,16.14 10.15,16.49 v10.49,16.49 | v7.54,24.37 10.68,24.37 v11,24.05 | X4.P$2 5.52,26.53 v4.75,25.76
  Bottom 0.254: v10.49,16.49 11.96,17.96 11.96,19.89 11.34,20.51 9.85,20.51 9.46,20.9 9.46,21.44 10.42,22.41 10.42,22.72 11,23.29 v11,24.05 | v7.54,24.37 7.54,25.72 4.79,25.72 v4.75,25.76 5.35,26.36 C2.1
N$3  (via drill 0.48)
  Top 0.254: U1.10 8.05,17.95 8.83,17.95 10.04,19.16 v10.29,19.16
  Bottom 0.254: v10.29,19.16 9.29,19.16 8.85,19.6 8.5,19.95 L2.2
N$4  (via drill 0.48 pad 0.8)
  Top 0.254: v3.68,4.03 3.68,3.11 3.84,2.95 CHG.C
  Bottom 0.254: R3.1 3.1,3.45 v3.68,4.03
N$5  (via drill 0.48 pad 0.8)
  Top 0.254: U8.16 11.47,10.25 11.35,10.13 11.35,7.93 v11.38,7.89
  Bottom 0.254: C3.1 16.6,7.16 16.34,7.42 11.85,7.42 v11.38,7.89
N$6  (via drill 0.3)
  Top 0.203: v5.45,11.84 5.45,11.4 5.04,11 3.31,11 3.17,11.13 3.17,11.43 IC1.10
  Bottom 0.203: v5.45,11.84 5.19,12.1 4.45,12.1 C12.1
N$7  (via drill 0.4 pad 0.8)
  other vias: 10.5,3.4
N$8  (via drill 0.48)
  Top 0.254: U1.9 8.91,18.6 11.48,21.17 11.48,22.3 11.06,22.72 v9.39,22.72
  Bottom 0.254: C4.1 7.19,23.15 7.3,23.04 L2.1 8.52,21.85 v9.39,22.72
N$9
  Bottom 0.254: U5.1 3.55,8.95 arc90 3.17,8.57 3.17,6.84 arc72 3.57,6.29 arc-148 3.54,5.15 R3.2
N$10  (via drill 0.48 pad 0.8)
  Top 0.254: v0.9,2.85 1.49,3.44 1.59,3.44 R8.1
  Bottom 0.254: v0.9,2.85 0.71,3.04 0.71,7.51 arc-90 1.34,8.14 arc90 1.6,8.4 U5.5
N$12
  Top 0.254: U$9.P$1 3.02,1.89 3.02,3.83 2.5,4.34 1.41,4.34 0.33,5.43 0.33,21.52 1.64,22.84 1.64,23.78 2.21,24.35 S2.1
N$15  (via drill 0.48 pad 0.8)
  Top 0.254: v16.15,8.3 15.91,8.3 15.45,7.85 14.05,7.85 13.75,8.14 U8.21
  Bottom 0.254: R4.1 16.5,8.66 v16.15,8.3
RESET  (via drill 0.3, 0.48 pad 0.8)
  Top 0.203: v10.81,1.55 10.76,1.59 v5.52,1.59 | SW1.A 6.33,9.8 6.56,9.57 v6.56,8.04
  Top 0.254: v19.7,25.75 19.7,24.51 18.69,23.5 U1.35 | SW1.A' 1.79,10.14 3.12,10.14 3.76,9.51 4.3,9.51 4.59,9.8 SW1.A
  Bottom 0.203: 19.77,0.83 19.34,0.39 14.96,0.39 14.11,1.24 11.28,1.24 10.98,1.55 v10.81,1.55 | v5.52,1.59 8.36,1.59 9.55,2.78 9.55,5.55 7.06,8.04 v6.56,8.04
  Bottom 0.254: 19.77,0.83 20.46,1.51 20.46,24.99 v19.7,25.75
RXD  (via drill 0.48)
  Top 0.254: v15.81,16.49 15.33,16.49 14.7,15.86 U1.21
  Bottom 0.254: R4.2 17.27,10.42 17.27,12.99 15.81,14.45 v15.81,16.49
SCK  (via drill 0.3)
  Top 0.203: U1.26 15.77,17.2 13.84,19.13 v12.47,19.13 | v4.65,15.19 v4.65,15.18 5.28,15.18 v6.6,13.86
  Bottom 0.203: v12.47,19.13 12.32,18.98 12.32,17.87 12.32,17.5 10.73,15.91 8.06,15.91 7.96,15.81 7.96,15.29 7.45,14.77 7.42,14.77 Q1.3 6.6,13.95 v6.6,13.86 | R6.6 2.7,15.67 2.94,15.43 4.41,15.43 v4.65,15.19
SCL/SCLK  (via drill 0.3)
  Top 0.203: v5.71,17.46 5.71,16.57 4.78,15.64 2.8,15.64 v2.44,15.29 2.3,15.14 IC1.23 | v4.42,17.93 3.92,17.42 2.48,17.42 1.52,18.37 v1.52,18.72 | v9.65,23.63 10.2,23.08 11.51,23.08 15.34,19.24 v16.04,19.24 | v18.42,17.7 18.55,17.82 18.56,17.82 18.93,18.2 U$7.P$9
  Bottom 0.203: Q1.4 5.17,14.45 5,14.63 3.1,14.63 v2.44,15.29 | v4.42,17.93 5.05,17.93 5.51,17.46 v5.71,17.46 | R6.1 1,18.05 1.06,18.11 1.06,18.73 | v9.65,23.63 9.55,23.53 7.4,23.53 6.96,23.97 2.35,23.97 1.06,22.68 1.06,18.73 | v16.04,19.24 16.44,19.24 17.97,17.71 18.41,17.71 v18.42,17.7 | v1.52,18.72 1.07,18.72 1.06,18.73
SDA/SDI  (via drill 0.3)
  Top 0.203: IC1.24 1.59,14.8 1.29,14.8 1.07,15.03 1.07,16.5 | 1.07,16.5 1.62,17.05 4.09,17.05 v4.25,16.89 | 1.07,16.5 1.07,19.6 2.08,20.61 2.98,20.61 3.94,21.57 3.94,22.96 5.27,24.3 5.27,25.5 5.41,25.63 6.59,25.63 7.15,25.07 10.75,25.07 11.55,24.27 11.55,23.51 15.3,19.75 v15.75,19.75 | v18.37,18.28 18.5,18.28 18.92,18.7 U$7.P$8
  Bottom 0.203: R6.5 4.08,16.15 4.25,16.31 v4.25,16.89 4.31,16.96 5.01,16.96 5.43,16.54 6.67,16.54 7.1,16.11 Q1.1 | v15.75,19.75 16.5,19.75 17.97,18.28 v18.37,18.28
TXD  (via drill 0.48 pad 0.8)
  Top 0.254: v12.05,8.53 12.05,8.34 12.55,7.85 12.95,7.85 13.25,8.14 U8.20 | U1.19 13.3,15.92 13.78,16.4 v14.15,16.4
  Bottom 0.254: v12.05,8.53 12.73,7.85 14.86,7.85 15.46,8.45 15.46,13.03 14.49,13.99 14.49,16.06 v14.15,16.4
USBD+
  Top 0.254: X3.D+ 10.5,7.17 10.56,7.23 12.09,7.23 12.32,7.46 16.77,7.46 17.25,7.95 17.25,9.82 16.82,10.25 U8.3
USBD-  (via drill 0.48)
  Top 0.254: U8.4 16.86,10.75 18.2,9.4 19.7,9.4 20.41,8.7 20.41,1.38 19.86,0.83 15.3,0.83 v14.95,1.18 | v11.29,2.01 11.26,2.04 8.51,2.04 8.42,2.12 8.42,4.73 8.48,4.79 9,4.79 9.81,5.6 9.81,6.24 X3.D-
  Bottom 0.254: v14.95,1.18 14.95,1.43 14.76,1.61 11.69,1.61 v11.29,2.01
VBAT  (via drill 0.48 pad 0.8)
  Top 0.254: v2.75,9.39 2.29,8.93 1.05,8.93 0.71,9.27 0.71,21.36 2.05,22.7 2.05,23.55 2.19,23.7 4.16,23.7 4.35,23.89 4.35,24.8 4.21,24.95 3.7,24.95 3.35,25.3 S2.2
  Bottom 0.254: C11.1 4.7,5.96 4.2,6.46 U5.3 4.81,7.05 5.12,7.36 5.12,9.26 4.91,9.48 2.84,9.48 v2.75,9.39 2.75,9.83 3.74,10.81 5.37,10.81 6.85,9.34 8.96,9.34 9.2,9.58 Q3.3
VBUS  (via drill 0.48, 0.48 pad 0.8)
  Top 0.254: 14.75,13.19 U8.8 | v2.87,6.07 3.58,6.07 CHG.A 4.6,6.9 5.2,7.5 7.59,7.5 8.81,6.28 X3.VBUS 9.2,7.11 9.46,7.37 9.88,7.37 10.38,7.86 10.38,8.32 10.95,8.89 10.95,11.78 11.69,12.53 v11.99,12.53 11.99,12.74 12.44,13.19 14.75,13.19 | 14.75,13.19 17.43,13.19 18.03,13.79 v18.59,13.79 18.9,13.48 D5.A
  Bottom 0.254: R12.2 18.82,8.63 19.21,8.63 19.55,8.98 19.55,12.83 v18.59,13.79 | v11.99,12.53 11.43,11.97 11.43,9.46 10.15,8.18 Q3.1 | U5.4 arc-90 1.63,7.02 1.63,6.43 arc90 1.99,6.07 v2.87,6.07
VIN  (via drill 0.48, 0.48 pad 0.8)
  Top 0.254: D5.C 18.96,8.39 18.96,6.83 18.98,6.81 v19.58,6.81 18.96,6.81 18.5,6.35 C10.1 15.56,4.41 15.56,2.29 15.41,2.14 12.79,2.14 12.64,2.29 12.64,3.79 v12.33,4.1 | v17.97,1.93 18.35,1.55 U3.1
  Bottom 0.254: v19.58,6.81 19.62,6.77 19.62,3.77 R5.2 18.72,3.35 18.49,3.12 18.49,2.44 v17.97,1.93 | v12.33,4.1 11.28,4.1 10.32,5.06 10.32,5.93 Q3.2